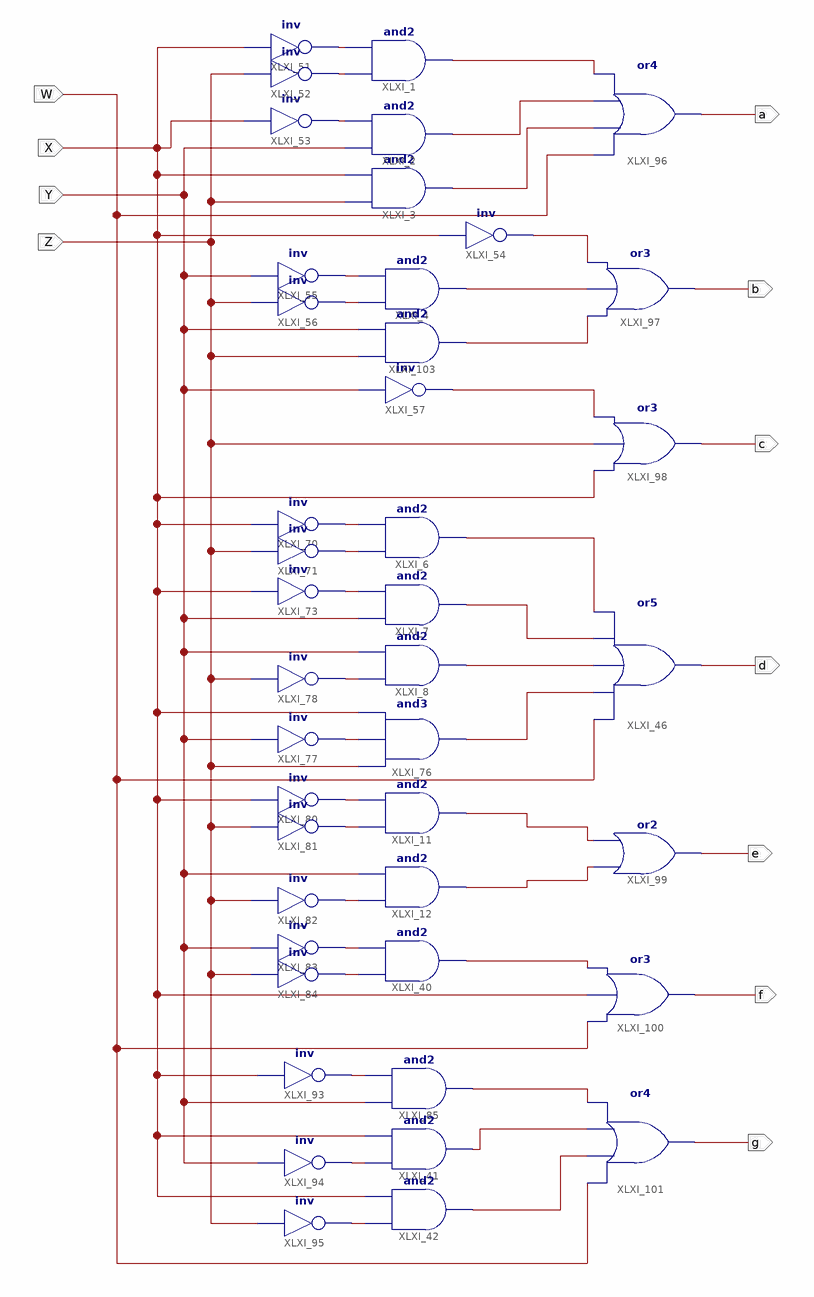
[diagram p0: schematic sheet 1]
// Xilinx ISE schematic Lab05_1.sch (spartan6) as structural Verilog: 42 symbols, 11 ports
module Lab05_1 (
  input  Z,
  input  Y,
  input  X,
  input  W,
  output a,
  output b,
  output c,
  output d,
  output e,
  output f,
  output g
);

  wire XLXN_1, XLXN_9, XLXN_22, XLXN_23, XLXN_24, XLXN_25, XLXN_26, XLXN_29, XLXN_30, XLXN_31, XLXN_48,
       XLXN_49, XLXN_50, XLXN_53, XLXN_54, XLXN_57, XLXN_58, XLXN_59, XLXN_60, XLXN_62, XLXN_63, XLXN_64,
       XLXN_67, XLXN_68, XLXN_69, XLXN_70, XLXN_71, XLXN_72, XLXN_77, XLXN_128, XLXN_129, XLXN_131, XLXN_132,
       XLXN_133, XLXN_134;

  and XLXI_3 (XLXN_129, Z, X);
  not XLXI_53 (XLXN_9, X);
  not XLXI_57 (XLXN_31, Y);
  and XLXI_4 (XLXN_29, XLXN_26, XLXN_25);
  not XLXI_56 (XLXN_26, Z);
  not XLXI_55 (XLXN_25, Y);
  not XLXI_54 (XLXN_24, X);
  not XLXI_51 (XLXN_22, X);
  not XLXI_52 (XLXN_23, Z);
  and XLXI_1 (XLXN_1, XLXN_23, XLXN_22);
  and XLXI_2 (XLXN_128, Y, XLXN_9);
  and XLXI_6 (XLXN_57, XLXN_49, XLXN_48);
  not XLXI_70 (XLXN_48, X);
  not XLXI_71 (XLXN_49, Z);
  and XLXI_7 (XLXN_58, Y, XLXN_50);
  not XLXI_73 (XLXN_50, X);
  and XLXI_8 (XLXN_59, XLXN_54, Y);
  not XLXI_78 (XLXN_54, Z);
  and XLXI_76 (XLXN_60, Z, XLXN_53, X);
  not XLXI_77 (XLXN_53, Y);
  and XLXI_11 (XLXN_131, XLXN_63, XLXN_62);
  and XLXI_12 (XLXN_132, XLXN_64, Y);
  not XLXI_80 (XLXN_62, X);
  not XLXI_81 (XLXN_63, Z);
  not XLXI_82 (XLXN_64, Z);
  and XLXI_40 (XLXN_69, XLXN_68, XLXN_67);
  not XLXI_83 (XLXN_67, Y);
  not XLXI_84 (XLXN_68, Z);
  and XLXI_85 (XLXN_77, Y, XLXN_70);
  and XLXI_41 (XLXN_133, XLXN_71, X);
  and XLXI_42 (XLXN_134, XLXN_72, X);
  not XLXI_93 (XLXN_70, X);
  not XLXI_94 (XLXN_71, Y);
  not XLXI_95 (XLXN_72, Z);
  or XLXI_46 (d, W, XLXN_60, XLXN_59, XLXN_58, XLXN_57);
  or XLXI_96 (a, W, XLXN_129, XLXN_128, XLXN_1);
  or XLXI_97 (b, XLXN_30, XLXN_29, XLXN_24);
  or XLXI_98 (c, X, Z, XLXN_31);
  or XLXI_99 (e, XLXN_132, XLXN_131);
  or XLXI_100 (f, W, X, XLXN_69);
  or XLXI_101 (g, W, XLXN_134, XLXN_133, XLXN_77);
  and XLXI_103 (XLXN_30, Z, Y);
endmodule
